# Altium schematic sheet 04_Sensor.SchDoc
size A4
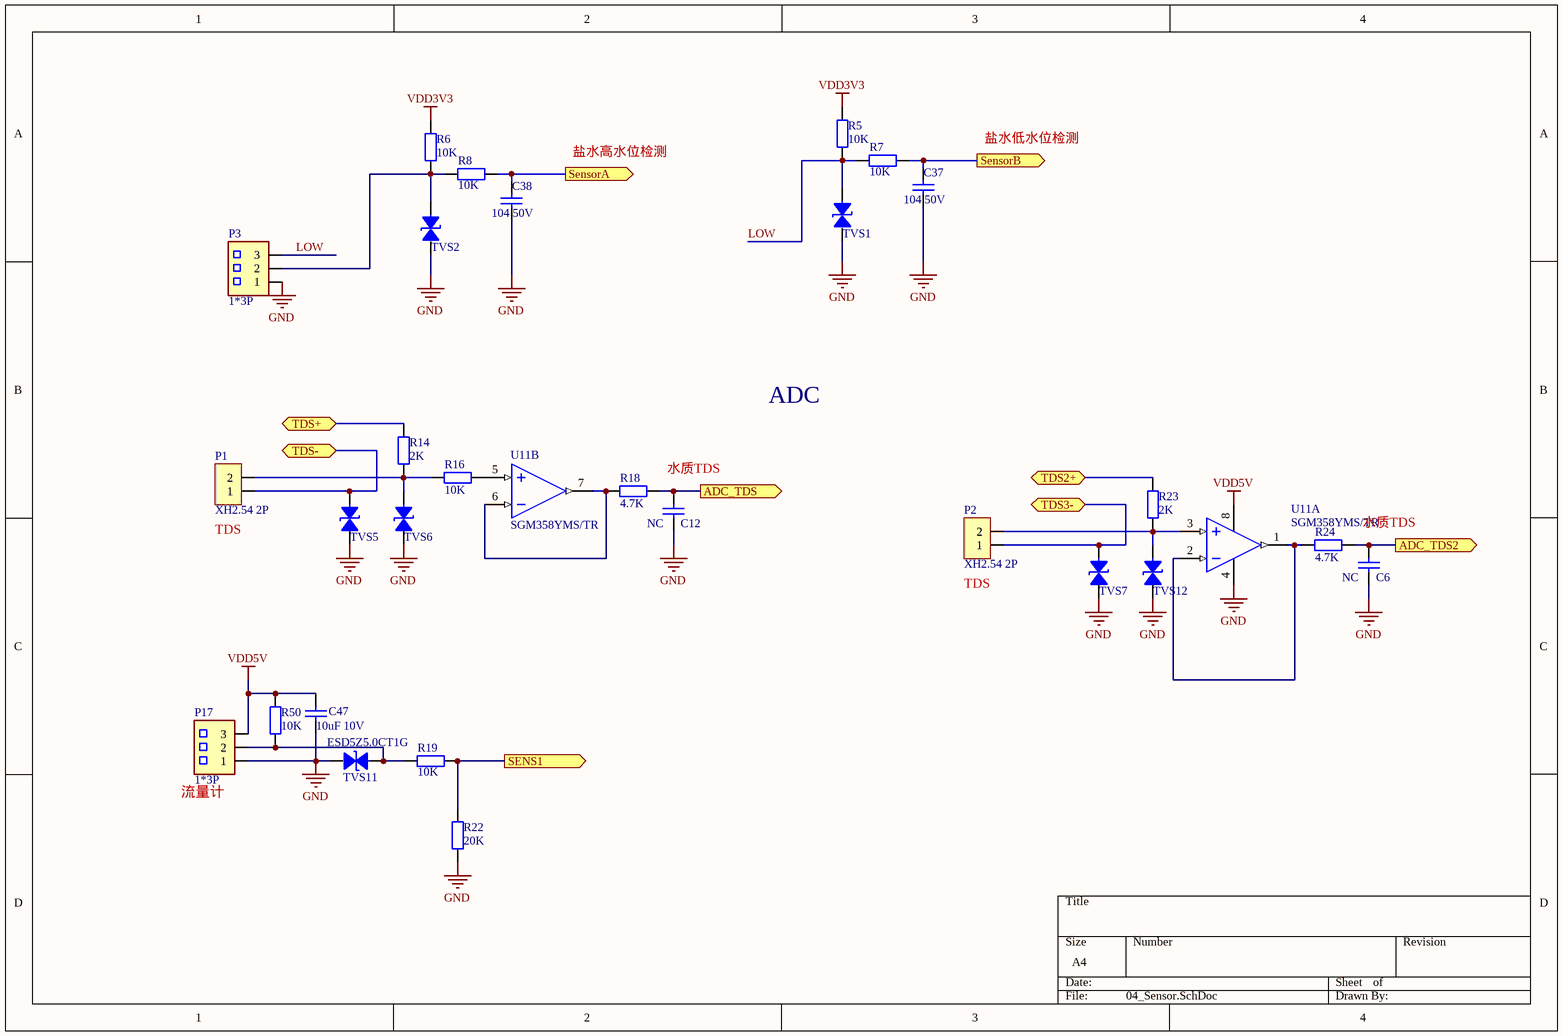
[diagram p0: 04_Sensor.SchDoc]

## Parts
C6  NC  [0603C]
C12  NC  [SMD-0603C]
C37  104 50V  [SMD-0603C]
C38  104 50V  [SMD-0603C]
C47  10uF 10V  [SMD-0603C]
P1  XH2.54 2P  [SIP-2A]
P2  XH2.54 2P  [SIP-2A]
P3  1*3P  [3X2MMZ]
P17  1*3P  [3X2.54MMZ2]
R5  10K  [SMD-0603]
R6  10K  [SMD-0603]
R7  10K  [SMD-0603]
R8  10K  [SMD-0603]
R14  2K  [SMD-0603]
R16  10K  [SMD-0603]
R18  4.7K  [SMD-0603]
R19  10K  [SMD-0603]
R22  20K  [SMD-0603]
R23  2K  [0603R]
R24  4.7K  [0603R]
R50  10K  [SMD-0603]
TVS1  ESD5Z5.0CT1G  [SOD-523]  (value not drawn)
TVS2  ESD5Z5.0CT1G  [SOD-523]  (value not drawn)
TVS5  ESD5Z5.0CT1G  [SOD-523]  (value not drawn)
TVS6  ESD5Z5.0CT1G  [SOD-523]  (value not drawn)
TVS7  ESD5Z5.0CT1G  [SOD-523]  (value not drawn)
TVS11  ESD5Z5.0CT1G  [SOD-523]
TVS12  ESD5Z5.0CT1G  [SOD-523]  (value not drawn)
U11  SGM358YMS/TR  [MSOP-8]  (parts A,B of 2)

## Ports
ADC_TDS2 (out), ADC_TDS (out), SENS1 (out), SensorA (out), SensorB (out), TDS2+ (bidir), TDS3- (bidir), TDS+ (bidir), TDS- (bidir)

## Nets
GND: C6.1 C12.1 C37.1 C38.1 C47.1 P3.1 P17.1 R22.1 TVS1.1(A) TVS2.1(A) TVS5.1(A) TVS6.1(A) TVS7.1(A) TVS11.1(A) TVS12.1(A) U11.4(V-)
VDD3V3: R5.1 R6.1
VDD5V: C47.2 P17.3 R50.1 U11.8(V+)
ADC_TDS: C12.2 R18.1 ; port ADC_TDS
ADC_TDS2: C6.2 R24.1 ; port ADC_TDS2
LOW: P3.3 R5.2 R7.1 TVS1.2(B)
SENS1: R19.2 R22.2 ; port SENS1
SensorA: C38.2 R8.2 ; port SensorA
SensorB: C37.2 R7.2 ; port SensorB
TDS2+: R23.1 ; port TDS2+
TDS3-: P2.1 TVS7.2(B) ; port TDS3-
TDS+: R14.1 ; port TDS+
TDS-: P1.1 TVS5.2(B) ; port TDS-
NetP1_2: P1.2 R14.2 R16.1 TVS6.2(B)
NetP2_2: P2.2 R23.2 TVS12.2(B) U11.3(IN1+)
NetP3_2: P3.2 R6.2 R8.1 TVS2.2(B)
NetP17_2: P17.2 R19.1 R50.2 TVS11.2(B)
NetR16_2: R16.2 U11.5(IN2+)
NetR18_2: R18.2 U11.6(IN2-) U11.7(OUT2)
NetR24_2: R24.2 U11.1(OUT1) U11.2(IN1-)

## Notes on the sheet
- 盐水高水位检测
- 盐水低水位检测
- ADC
- 水质TDS
- (near P1) TDS
- (near P2) TDS
- (near P17) 流量计

## Library data of the parts
C6 C12 = CAP4: 贴片电容 10%
C37 C38 = CAP4: 贴片电容 20%
C47 = 0805 22uF (226) 20% 25V: 贴片电容 10%; value: 22uF 10V X5R; ComponentLink1Description: 供应商链接; ComponentLink1URL: http://www.szlcsc.com/product/details_46786.html; Package: 0805; Supplier: LC; SuppliersPartNumber: C45783
P1 P2 = SIP-2: XH2.54 2P 直插
P3 P17 = HDR1*3
R5-R8 R14 R16 R23 = RES0: 贴片电阻 1%
R18 R24 = RES0: 贴片电阻 5%
R19 R22 R50 = 0603 10KΩ (1002) 1%: 贴片电阻 5%; ComponentLink1Description: 供应商链接; ComponentLink1URL: http://www.szlcsc.com/product/details_26547.html; Package: 0603; Supplier: LC; SuppliersPartNumber: C25804
TVS1 TVS2 TVS5-TVS7 TVS12 = TVS-1: TVS
TVS11 = TVS-1: TVS 5.0V
U11 = LM358: 运放